# EAGLE schematic IVSTAGE (EAGLE 5.07)
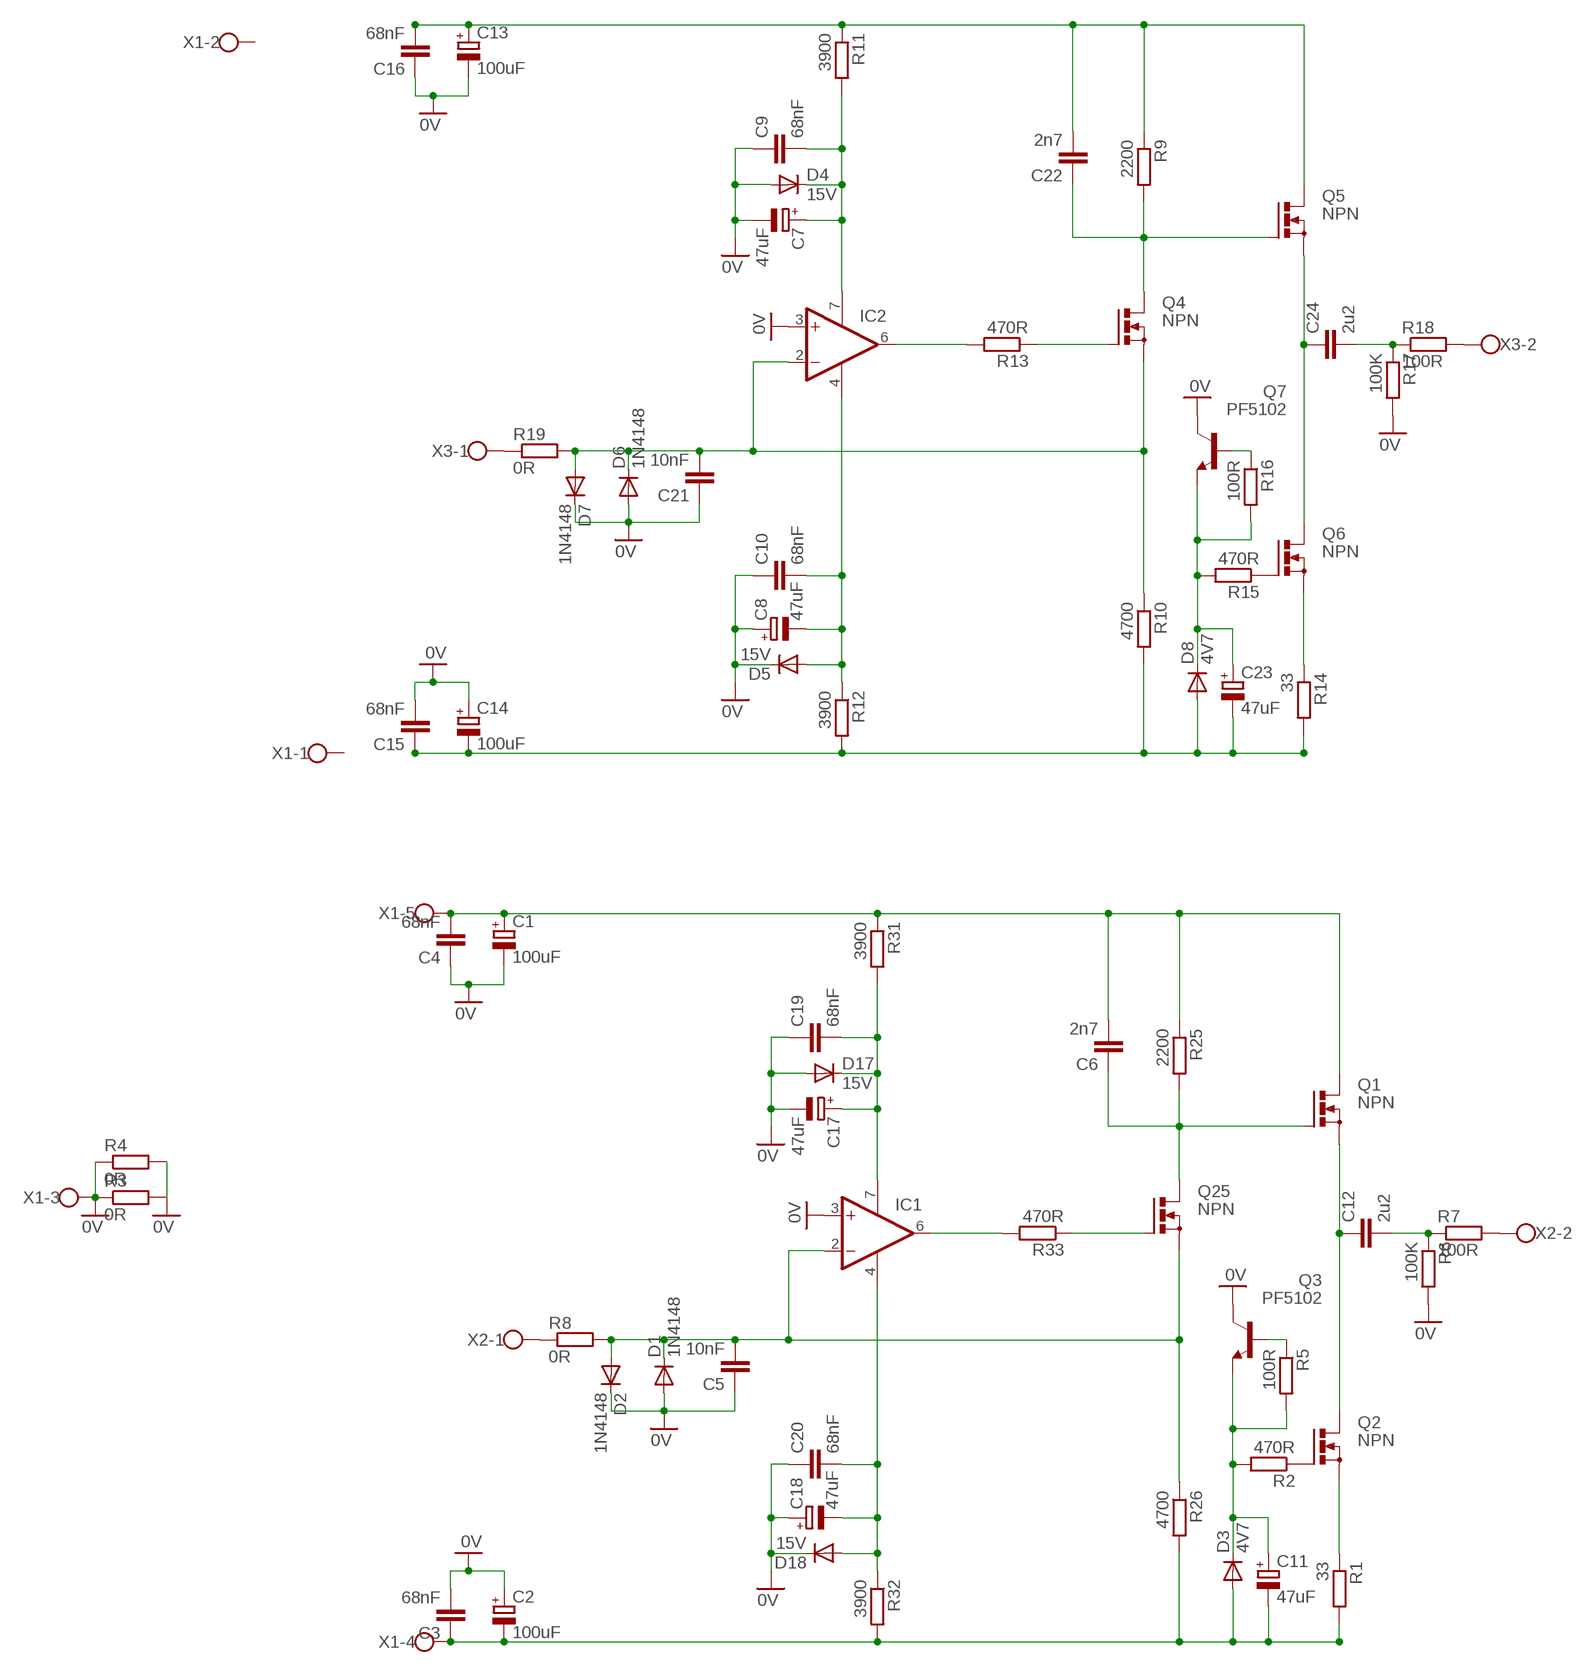
[diagram p0: schematic, sheet 1]

## Parts
C1  100uF  CPOL-EUE7.5-16  [E7,5-16]
C2  100uF  CPOL-EUE7.5-16  [E7,5-16]
C3  68nF  C-EU050-035X075  [C050-035X075]
C4  68nF  C-EU050-035X075  [C050-035X075]
C5  10nF  C-EU050-035X075  [C050-035X075]
C6  2n7  C-EU050-035X075  [C050-035X075]
C7  47uF  CPOL-EUE3.5-8  [E3,5-8]
C8  47uF  CPOL-EUE3.5-8  [E3,5-8]
C9  68nF  C-EU050-035X075  [C050-035X075]
C10  68nF  C-EU050-035X075  [C050-035X075]
C11  47uF  CPOL-EUE3.5-8  [E3,5-8]
C12  2u2  C37/19  [C37.5B19]
C13  100uF  CPOL-EUE7.5-16  [E7,5-16]
C14  100uF  CPOL-EUE7.5-16  [E7,5-16]
C15  68nF  C-EU050-035X075  [C050-035X075]
C16  68nF  C-EU050-035X075  [C050-035X075]
C17  47uF  CPOL-EUE3.5-8  [E3,5-8]
C18  47uF  CPOL-EUE3.5-8  [E3,5-8]
C19  68nF  C-EU050-035X075  [C050-035X075]
C20  68nF  C-EU050-035X075  [C050-035X075]
C21  10nF  C-EU050-035X075  [C050-035X075]
C22  2n7  C-EU050-035X075  [C050-035X075]
C23  47uF  CPOL-EUE3.5-8  [E3,5-8]
C24  2u2  C37/19  [C37.5B19]
D1  1N4148  1N4004  [DO41-10]
D2  1N4148  1N4004  [DO41-10]
D3  4V7  1N4004  [DO41-10]
D4  15V  1N4004  [DO41-10]
D5  15V  1N4004  [DO41-10]
D6  1N4148  1N4004  [DO41-10]
D7  1N4148  1N4004  [DO41-10]
D8  4V7  1N4004  [DO41-10]
D17  15V  1N4004  [DO41-10]
D18  15V  1N4004  [DO41-10]
IC1  1AMP_P7+4N  [DIL08]
IC2  1AMP_P7+4N  [DIL08]
Q1  NPN  PMOSFET_NTO220BH  [TO220BH]
Q2  NPN  PMOSFET_NTO220BH  [TO220BH]
Q3  PF5102  BC550B  [TO92-EBC]
Q4  NPN  PMOSFET_NTO220BH  [TO220BH]
Q5  NPN  PMOSFET_NTO220BH  [TO220BH]
Q6  NPN  PMOSFET_NTO220BH  [TO220BH]
Q7  PF5102  BC550B  [TO92-EBC]
Q25  NPN  PMOSFET_NTO220BH  [TO220BH]
R1  33  R-EU_0309/12  [0309/12]
R2  470R  R-EU_0204/7  [0204/7]
R3  0R  R-EU_0207/10  [0207/10]
R4  0R  R-EU_0207/10  [0207/10]
R5  100R  R-EU_0204/7  [0204/7]
R6  100K  R-EU_0204/7  [0204/7]
R7  100R  R-EU_0309/12  [0309/12]
R8  0R  R-EU_0207/10  [0207/10]
R9  2200  R-EU_0617/22  [0617/22]
R10  4700  R-EU_0617/22  [0617/22]
R11  3900  R-EU_0309/12  [0309/12]
R12  3900  R-EU_0309/12  [0309/12]
R13  470R  R-EU_0204/7  [0204/7]
R14  33  R-EU_0309/12  [0309/12]
R15  470R  R-EU_0204/7  [0204/7]
R16  100R  R-EU_0204/7  [0204/7]
R17  100K  R-EU_0204/7  [0204/7]
R18  100R  R-EU_0309/12  [0309/12]
R19  0R  R-EU_0207/10  [0207/10]
R25  2200  R-EU_0617/22  [0617/22]
R26  4700  R-EU_0617/22  [0617/22]
R31  3900  R-EU_0309/12  [0309/12]
R32  3900  R-EU_0309/12  [0309/12]
R33  470R  R-EU_0204/7  [0204/7]
X1  W237-05P  [W237-5P]
X2  W237-02P  [W237-132]
X3  W237-02P  [W237-132]

## Nets
0V: C1.- C2.+ C3.2 C4.1 C5.1 C7.- C8.+ C9.1 C10.1 C13.- C14.+ C15.2 C16.1 C17.- C18.+ C19.1 C20.1 C21.1 D1.A D2.C D4.A D5.C D6.A D7.C D17.A D18.C IC1.3(+IN) IC2.3(+IN) Q3.C Q7.C R3.1 R3.2 R4.1 R4.2 R6.2 R17.2 X1.3
N$1: C6.1 Q1.G Q25.D R25.2
N$2: Q2.S R1.1
N$3: C12.1 Q1.S Q2.D
N$4: C14.- C15.1 C23.- D8.A R10.2 R12.2 R14.2
N$5: C13.+ C16.2 C22.2 Q5.D R9.1 R11.1
N$6: Q2.G R2.1
N$7: C11.+ D3.C Q3.E R2.2 R5.2
N$8: C22.1 Q4.D Q5.G R9.2
N$9: Q3.B R5.1
N$10: C21.2 D6.C D7.A IC2.2(-IN) Q4.S R10.1 R19.2
N$11: C12.2 R6.1 R7.1
N$12: R8.1 X2.1
N$13: R7.2 X2.2
N$14: C8.- C10.2 D5.A IC2.4(V-) R12.1
N$15: C7.+ C9.2 D4.C IC2.7(V+) R11.2
N$16: Q4.G R13.1
N$17: IC2.6(OUT) R13.2
N$18: C24.1 Q5.S Q6.D
N$19: Q6.G R15.1
N$20: Q6.S R14.1
N$21: C23.+ D8.C Q7.E R15.2 R16.2
N$22: Q7.B R16.1
N$23: C2.- C3.1 C11.- D3.A R1.2 R26.2 R32.2 X1.4
N$24: C24.2 R17.1 R18.1
N$25: R19.1 X3.1
N$26: C1.+ C4.2 C6.2 Q1.D R25.1 R31.1 X1.5
N$27: R18.2 X3.2
N$33: C5.2 D1.C D2.A IC1.2(-IN) Q25.S R8.2 R26.1
N$57: C18.- C20.2 D18.A IC1.4(V-) R32.1
N$58: C17.+ C19.2 D17.C IC1.7(V+) R31.2
N$63: Q25.G R33.1
N$64: IC1.6(OUT) R33.2
Unconnected: X1.1 X1.2

## Library data of the parts
C1 C2 C7 C8 C11 C13 C14 C17 C18 C23 = resistor:CPOL-EU: POLARIZED CAPACITOR, European symbol
C3-C6 C9 C10 C15 C16 C19-C22 = resistor:C-EU: CAPACITOR, European symbol
C12 C24 = capacitor-wima:C: CAPACITOR naming: grid - package width
D1-D8 D17 D18 = diode:1N4004: DIODE general purpose rectifier, 1 A
IC1 IC2 = linear:1AMP_P7+4: OP AMP
Q1 Q2 Q4-Q6 Q25 = transistor-power:PMOSFET_N: Power MOSFET N-Channel
Q3 Q7 = transistor-npn:BC550*: NPN Transistor
R1-R19 R25 R26 R31-R33 = resistor:R-EU_: RESISTOR, European symbol
X1 = con-wago-508:W237-05P: WAGO SREW CLAMP
X2 X3 = con-wago-508:W237-02P: WAGO SREW CLAMP